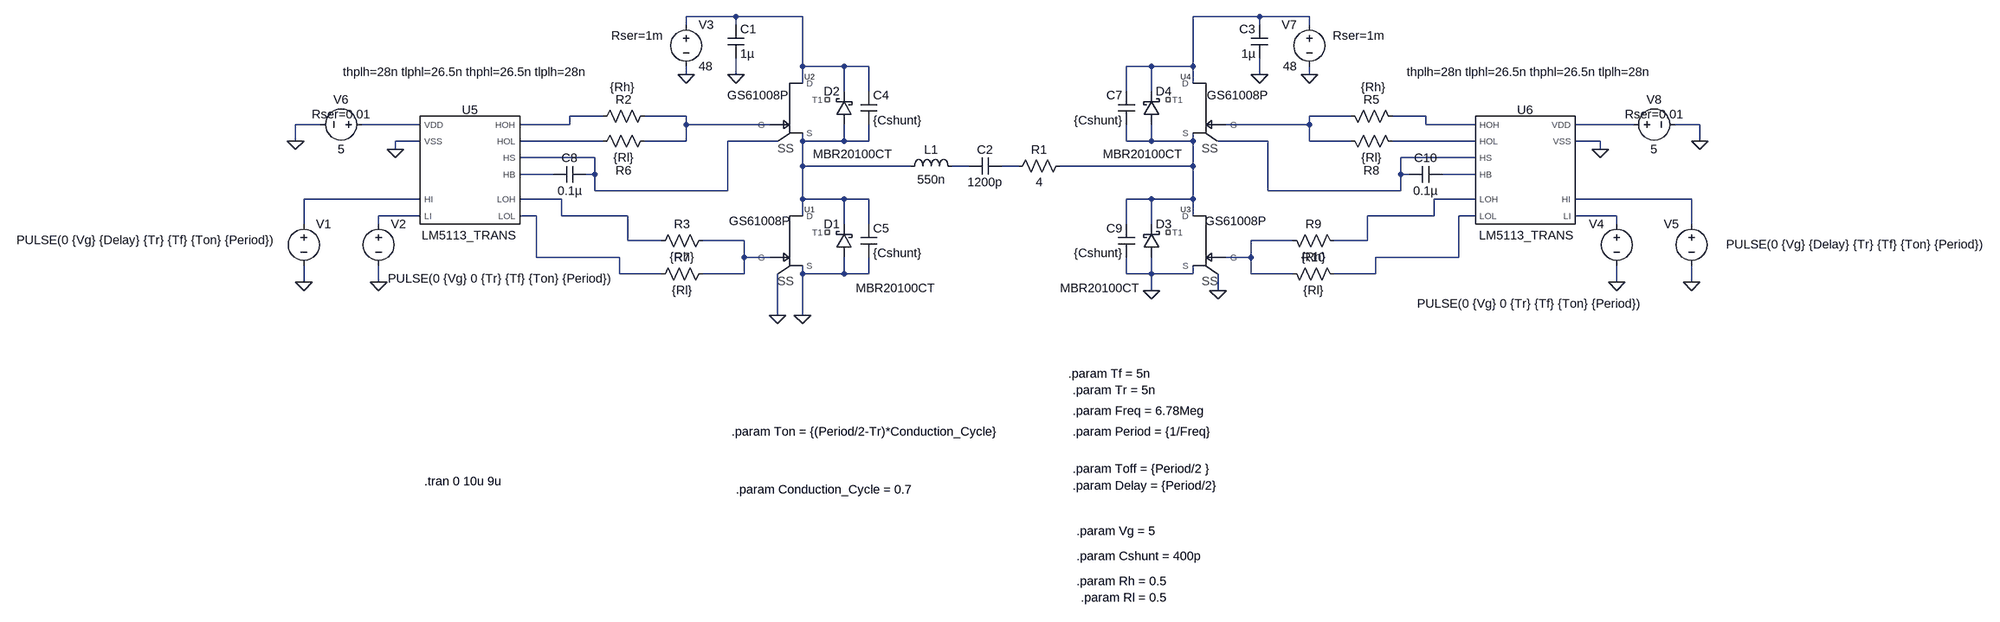
[diagram p0: schematic class_DE_bridge.asc]
class_DE_bridge.asc, the LTspice schematic file:
Version 4
SHEET 1 2716 896
WIRE 16 -240 -80 -240
WIRE 144 -240 16 -240
WIRE 1024 -240 896 -240
WIRE 1120 -240 1024 -240
WIRE -80 -224 -80 -240
WIRE 16 -224 16 -240
WIRE 1024 -224 1024 -240
WIRE 1120 -224 1120 -240
WIRE 144 -144 144 -240
WIRE 224 -144 144 -144
WIRE 272 -144 224 -144
WIRE 816 -144 768 -144
WIRE 896 -144 896 -240
WIRE 896 -144 816 -144
WIRE -80 -128 -80 -144
WIRE 16 -128 16 -160
WIRE 1024 -128 1024 -160
WIRE 1120 -128 1120 -144
WIRE 144 -112 144 -144
WIRE 896 -112 896 -144
WIRE 224 -96 224 -144
WIRE 272 -96 272 -144
WIRE 768 -96 768 -144
WIRE 816 -96 816 -144
WIRE -240 -48 -304 -48
WIRE -80 -48 -160 -48
WIRE 1200 -48 1120 -48
WIRE 1344 -48 1280 -48
WIRE -784 -32 -832 -32
WIRE -592 -32 -704 -32
WIRE -304 -32 -304 -48
WIRE -304 -32 -400 -32
WIRE -80 -32 -80 -48
WIRE 80 -32 -80 -32
WIRE 1120 -32 1120 -48
WIRE 1120 -32 960 -32
WIRE 1344 -32 1344 -48
WIRE 1440 -32 1344 -32
WIRE 1744 -32 1632 -32
WIRE 1872 -32 1824 -32
WIRE -832 0 -832 -32
WIRE -592 0 -640 0
WIRE -240 0 -400 0
WIRE -80 0 -80 -32
WIRE -80 0 -160 0
WIRE 96 0 0 0
WIRE 144 0 144 -16
WIRE 224 0 224 -32
WIRE 224 0 144 0
WIRE 272 0 272 -32
WIRE 272 0 224 0
WIRE 768 0 768 -32
WIRE 816 0 816 -32
WIRE 816 0 768 0
WIRE 896 0 896 -16
WIRE 896 0 816 0
WIRE 1040 0 944 0
WIRE 1120 0 1120 -32
WIRE 1200 0 1120 0
WIRE 1440 0 1280 0
WIRE 1680 0 1632 0
WIRE 1872 0 1872 -32
WIRE -640 16 -640 0
WIRE 1680 16 1680 0
WIRE -256 32 -400 32
WIRE 1440 32 1296 32
WIRE 144 48 144 0
WIRE 352 48 144 48
WIRE 464 48 432 48
WIRE 560 48 528 48
WIRE 896 48 896 0
WIRE 896 48 640 48
WIRE -336 64 -400 64
WIRE -256 64 -256 32
WIRE -256 64 -272 64
WIRE 1296 64 1296 32
WIRE 1312 64 1296 64
WIRE 1440 64 1376 64
WIRE -256 96 -256 64
WIRE 0 96 0 0
WIRE 0 96 -256 96
WIRE 1040 96 1040 0
WIRE 1296 96 1296 64
WIRE 1296 96 1040 96
WIRE -592 112 -816 112
WIRE -320 112 -400 112
WIRE 144 112 144 48
WIRE 224 112 144 112
WIRE 272 112 224 112
WIRE 816 112 768 112
WIRE 896 112 896 48
WIRE 896 112 816 112
WIRE 1440 112 1360 112
WIRE 1856 112 1632 112
WIRE -592 144 -672 144
WIRE -368 144 -400 144
WIRE -320 144 -320 112
WIRE -192 144 -320 144
WIRE 144 144 144 112
WIRE 896 144 896 112
WIRE 1360 144 1360 112
WIRE 1360 144 1232 144
WIRE 1440 144 1408 144
WIRE 1712 144 1632 144
WIRE -816 160 -816 112
WIRE -672 160 -672 144
WIRE 224 160 224 112
WIRE 272 160 272 112
WIRE 768 160 768 112
WIRE 816 160 816 112
WIRE 1712 160 1712 144
WIRE 1856 160 1856 112
WIRE -192 192 -192 144
WIRE -128 192 -192 192
WIRE 32 192 -48 192
WIRE 1088 192 1008 192
WIRE 1232 192 1232 144
WIRE 1232 192 1168 192
WIRE -368 224 -368 144
WIRE -208 224 -368 224
WIRE 32 224 32 192
WIRE 80 224 32 224
WIRE 1008 224 1008 192
WIRE 1008 224 960 224
WIRE 1408 224 1408 144
WIRE 1408 224 1248 224
WIRE -208 256 -208 224
WIRE -128 256 -208 256
WIRE 32 256 32 224
WIRE 32 256 -48 256
WIRE 144 256 144 240
WIRE 224 256 224 224
WIRE 224 256 144 256
WIRE 272 256 272 224
WIRE 272 256 224 256
WIRE 768 256 768 224
WIRE 816 256 816 224
WIRE 816 256 768 256
WIRE 896 256 896 240
WIRE 896 256 816 256
WIRE 1008 256 1008 224
WIRE 1088 256 1008 256
WIRE 1248 256 1248 224
WIRE 1248 256 1168 256
WIRE -816 272 -816 240
WIRE -672 272 -672 240
WIRE 1712 272 1712 240
WIRE 1856 272 1856 240
WIRE 816 288 816 256
WIRE 944 288 944 256
WIRE 96 336 96 256
WIRE 144 336 144 256
FLAG 144 336 0
FLAG -80 -128 0
FLAG 16 -128 0
FLAG -672 272 0
FLAG -816 272 0
FLAG -640 16 0
FLAG -832 0 0
FLAG 1120 -128 0
FLAG 1024 -128 0
FLAG 1712 272 0
FLAG 1856 272 0
FLAG 1680 16 0
FLAG 1872 0 0
FLAG 816 288 0
FLAG 944 288 0
FLAG 96 336 0
SYMBOL GaN_E-HEMT_LT_GS61008P 96 192 R0
WINDOW 3 -34 -38 Center 2
SYMATTR InstName U1
SYMBOL GaN_E-HEMT_LT_GS61008P 96 -64 R0
WINDOW 3 -38 -24 Center 2
SYMATTR InstName U2
SYMBOL voltage -816 144 R0
WINDOW 3 162 121 Left 2
WINDOW 123 0 0 Left 2
WINDOW 39 0 0 Left 2
SYMATTR Value PULSE(0 {Vg} 0 {Tr} {Tf} {Ton} {Period})
SYMATTR InstName V1
SYMBOL voltage -672 144 R0
WINDOW 3 -697 47 Left 2
WINDOW 123 0 0 Left 2
WINDOW 39 0 0 Left 2
SYMATTR Value PULSE(0 {Vg} {Delay} {Tr} {Tf} {Ton} {Period})
SYMATTR InstName V2
SYMBOL voltage -80 -240 R0
WINDOW 123 0 0 Left 2
WINDOW 39 -144 37 Left 2
SYMATTR SpiceLine Rser=1m
SYMATTR InstName V3
SYMATTR Value 48
SYMBOL cap 0 -224 R0
SYMATTR InstName C1
SYMATTR Value 1µ
SYMBOL ind 336 64 R270
WINDOW 0 32 56 VTop 2
WINDOW 3 5 56 VBottom 2
SYMATTR InstName L1
SYMATTR Value 550n
SYMBOL cap 528 32 R90
WINDOW 0 0 32 VBottom 2
WINDOW 3 32 32 VTop 2
SYMATTR InstName C2
SYMATTR Value 1200p
SYMBOL res 656 32 R90
WINDOW 0 0 56 VBottom 2
WINDOW 3 32 56 VTop 2
SYMATTR InstName R1
SYMATTR Value 4
SYMBOL cap 256 -96 R0
SYMATTR InstName C4
SYMATTR Value {Cshunt}
SYMBOL cap 256 160 R0
SYMATTR InstName C5
SYMATTR Value {Cshunt}
SYMBOL schottky 240 224 R180
WINDOW 0 24 64 Left 2
WINDOW 3 -160 -59 Left 2
SYMATTR InstName D1
SYMATTR Value MBR20100CT
SYMBOL schottky 240 -32 R180
WINDOW 0 24 64 Left 2
WINDOW 3 -77 -57 Left 2
SYMATTR InstName D2
SYMATTR Value MBR20100CT
SYMBOL LM5113_TRANS -496 64 R0
WINDOW 39 -8 -213 Top 2
SYMATTR InstName U5
SYMBOL voltage -688 -32 R90
WINDOW 0 -32 56 VBottom 2
WINDOW 3 32 56 VTop 2
WINDOW 123 0 0 Left 2
WINDOW 39 -4 56 VBottom 2
SYMATTR InstName V6
SYMATTR Value 5
SYMATTR SpiceLine Rser=0.01
SYMBOL res -256 -32 R270
WINDOW 0 32 56 VTop 2
WINDOW 3 88 53 VBottom 2
SYMATTR InstName R2
SYMATTR Value {Rh}
SYMBOL res -144 -16 R90
WINDOW 0 88 56 VBottom 2
WINDOW 3 32 56 VTop 2
SYMATTR InstName R6
SYMATTR Value {Rl}
SYMBOL cap -272 48 R90
WINDOW 0 0 32 VBottom 2
WINDOW 3 32 32 VTop 2
SYMATTR InstName C8
SYMATTR Value 0.1µ
SYMBOL res -32 176 R90
WINDOW 0 0 56 VBottom 2
WINDOW 3 32 56 VTop 2
SYMATTR InstName R3
SYMATTR Value {Rh}
SYMBOL res -32 240 R90
WINDOW 0 0 56 VBottom 2
WINDOW 3 32 56 VTop 2
SYMATTR InstName R7
SYMATTR Value {Rl}
SYMBOL GaN_E-HEMT_LT_GS61008P 944 192 M0
WINDOW 3 -34 -38 Center 2
SYMATTR InstName U3
SYMBOL GaN_E-HEMT_LT_GS61008P 944 -64 M0
WINDOW 3 -38 -24 Center 2
SYMATTR InstName U4
SYMBOL voltage 1712 144 M0
WINDOW 3 -46 169 Left 2
WINDOW 123 0 0 Left 2
WINDOW 39 0 0 Left 2
SYMATTR Value PULSE(0 {Vg} 0 {Tr} {Tf} {Ton} {Period})
SYMATTR InstName V4
SYMBOL voltage 1856 144 M0
WINDOW 3 -562 55 Left 2
WINDOW 123 0 0 Left 2
WINDOW 39 0 0 Left 2
SYMATTR Value PULSE(0 {Vg} {Delay} {Tr} {Tf} {Ton} {Period})
SYMATTR InstName V5
SYMBOL voltage 1120 -240 M0
WINDOW 123 0 0 Left 2
WINDOW 39 -144 37 Left 2
SYMATTR SpiceLine Rser=1m
SYMATTR InstName V7
SYMATTR Value 48
SYMBOL cap 1040 -224 M0
SYMATTR InstName C3
SYMATTR Value 1µ
SYMBOL cap 784 -96 M0
SYMATTR InstName C7
SYMATTR Value {Cshunt}
SYMBOL cap 784 160 M0
SYMATTR InstName C9
SYMATTR Value {Cshunt}
SYMBOL schottky 800 224 M180
WINDOW 0 24 64 Left 2
WINDOW 3 -160 -59 Left 2
SYMATTR InstName D3
SYMATTR Value MBR20100CT
SYMBOL schottky 800 -32 M180
WINDOW 0 24 64 Left 2
WINDOW 3 -77 -57 Left 2
SYMATTR InstName D4
SYMATTR Value MBR20100CT
SYMBOL LM5113_TRANS 1536 64 M0
WINDOW 39 -8 -213 Top 2
SYMATTR InstName U6
SYMBOL voltage 1728 -32 M90
WINDOW 0 -32 56 VBottom 2
WINDOW 3 32 56 VTop 2
WINDOW 123 0 0 Left 2
WINDOW 39 -4 56 VBottom 2
SYMATTR InstName V8
SYMATTR Value 5
SYMATTR SpiceLine Rser=0.01
SYMBOL res 1296 -32 M270
WINDOW 0 32 56 VTop 2
WINDOW 3 88 53 VBottom 2
SYMATTR InstName R5
SYMATTR Value {Rh}
SYMBOL res 1184 -16 M90
WINDOW 0 88 56 VBottom 2
WINDOW 3 32 56 VTop 2
SYMATTR InstName R8
SYMATTR Value {Rl}
SYMBOL cap 1312 48 M90
WINDOW 0 0 32 VBottom 2
WINDOW 3 32 32 VTop 2
SYMATTR InstName C10
SYMATTR Value 0.1µ
SYMBOL res 1072 176 M90
WINDOW 0 0 56 VBottom 2
WINDOW 3 32 56 VTop 2
SYMATTR InstName R9
SYMATTR Value {Rh}
SYMBOL res 1072 240 M90
WINDOW 0 0 56 VBottom 2
WINDOW 3 32 56 VTop 2
SYMATTR InstName R10
SYMATTR Value {Rl}
TEXT 656 448 Left 2 !.param Tf = 5n
TEXT 664 480 Left 2 !.param Tr = 5n
TEXT 664 520 Left 2 !.param Freq = 6.78Meg
TEXT 664 560 Left 2 !.param Period = {1/Freq}
TEXT 8 560 Left 2 !.param Ton = {(Period/2-Tr)*Conduction_Cycle}
TEXT 664 632 Left 2 !.param Toff = {Period/2 }
TEXT 664 664 Left 2 !.param Delay = {Period/2}
TEXT -584 656 Left 2 !.tran 0 10u 9u
TEXT 16 672 Left 2 !.param Conduction_Cycle = 0.7
TEXT 672 752 Left 2 !.param Vg = 5
TEXT 672 800 Left 2 !.param Cshunt = 400p
TEXT 672 848 Left 2 !.param Rh = 0.5
TEXT 680 880 Left 2 !.param Rl = 0.5

The netlist it stands for:
* class_DE_bridge.asc
XU1 N027 N011 0 0 NC_01 GS61008P  ; pins G D S SS T1
XU2 N004 N001 N011 N010 NC_02 GS61008P  ; pins G D S SS T1
V1 N019 0 PULSE(0 {Vg} 0 {Tr} {Tf} {Ton} {Period})
V2 N023 0 PULSE(0 {Vg} {Delay} {Tr} {Tf} {Ton} {Period})
V3 N001 0 48 Rser=1m
C1 N001 0 1µ
L1 N011 N015 550n
C2 N016 N015 1200p
R1 N012 N016 4
C4 N001 N011 {Cshunt}
C5 N011 0 {Cshunt}
D1 0 N011 MBR20100CT
D2 N011 N001 MBR20100CT
XU5 N003 N009 N017 N019 N010 N023 N020 N024 N007 0 LM5113_TRANS thplh=28n tlphl=26.5n thphl=26.5n tlplh=28n  ; pins HOH HOL HB HI HS LI LOH LOL VDD VSS
V6 N007 0 5 Rser=0.01
R2 N003 N004 {Rh}
R6 N004 N009 {Rl}
C8 N010 N017 0.1µ
R3 N027 N020 {Rh}
R7 N027 N024 {Rl}
XU3 N028 N012 0 0 NC_03 GS61008P  ; pins G D S SS T1
XU4 N005 N002 N012 N013 NC_04 GS61008P  ; pins G D S SS T1
V4 N026 0 PULSE(0 {Vg} 0 {Tr} {Tf} {Ton} {Period})
V5 N022 0 PULSE(0 {Vg} {Delay} {Tr} {Tf} {Ton} {Period})
V7 N002 0 48 Rser=1m
C3 N002 0 1µ
C7 N002 N012 {Cshunt}
C9 N012 0 {Cshunt}
D3 0 N012 MBR20100CT
D4 N012 N002 MBR20100CT
XU6 N006 N014 N018 N022 N013 N026 N021 N025 N008 0 LM5113_TRANS thplh=28n tlphl=26.5n thphl=26.5n tlplh=28n  ; pins HOH HOL HB HI HS LI LOH LOL VDD VSS
V8 N008 0 5 Rser=0.01
R5 N006 N005 {Rh}
R8 N005 N014 {Rl}
C10 N013 N018 0.1µ
R9 N028 N021 {Rh}
R10 N028 N025 {Rl}
.model D D
.lib standard.dio
.param Tf = 5n
.param Tr = 5n
.param Freq = 6.78Meg
.param Period = {1/Freq}
.param Ton = {(Period/2-Tr)*Conduction_Cycle}
.param Toff = {Period/2 }
.param Delay = {Period/2}
.tran 0 10u 9u
.param Conduction_Cycle = 0.7
.param Vg = 5
.param Cshunt = 400p
.param Rh = 0.5
.param Rl = 0.5
.lib GaN_LTspice_GS61008P_Release1p27.lib
.lib Z:\home\wbraun\projects\ionophoney\simulation\ltspice\LM5113.lib
.backanno
.end